# Altium project Cubesat EPS.PrjPcb (part 4 of 4)

## Sheet Ports.SchDoc
size 420 x 297 mm; SheetNumber: 21; SheetTotal: 21
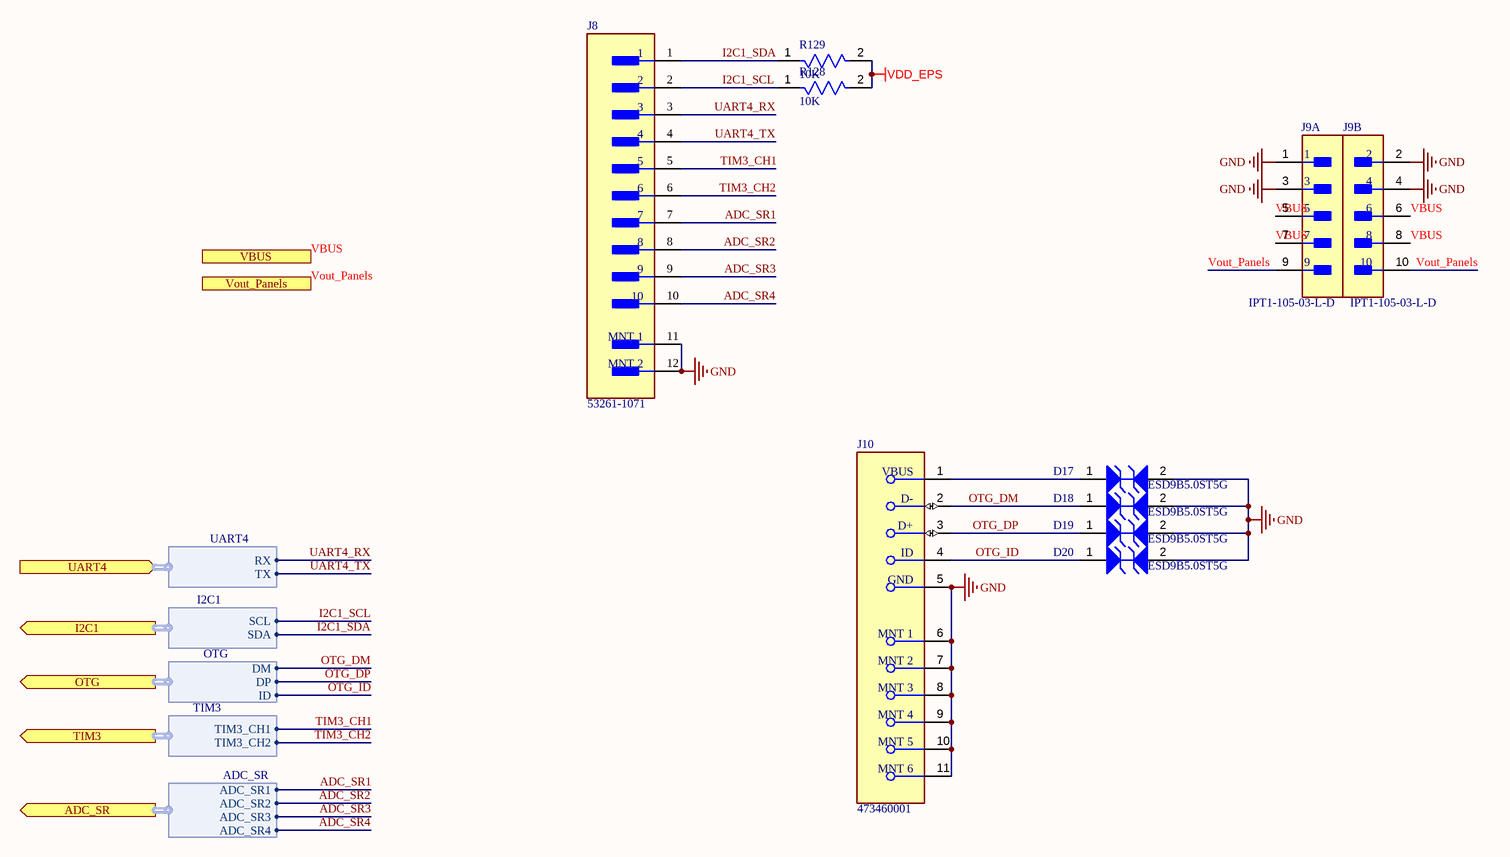
[diagram p18: Ports.SchDoc]

### Parts
D17  ESD9B5.0ST5G  [ONSC-SOD-923-2-514AB-01_V]
D18  ESD9B5.0ST5G  [ONSC-SOD-923-2-514AB-01_V]
D19  ESD9B5.0ST5G  [ONSC-SOD-923-2-514AB-01_V]
D20  ESD9B5.0ST5G  [ONSC-SOD-923-2-514AB-01_V]
J8  53261-1071  [FP-532611071-MFG]
J9  IPT1-105-03-L-D  [FP-IPT1-105-03-L-D-MFG]  (parts A,B of 2)
J10  473460001  [FP-473460001-MFG]
R128  10K  [FP-RK73B1J-MFG]
R129  10K  [FP-RK73B1J-MFG]

### Ports
ADC_SR (out, harness ADC_SR), I2C1 (out, harness I2C1), OTG (out, harness OTG), TIM3 (out, harness TIM3), UART4 (in, harness UART4), VBUS, Vout_Panels

### Harnesses
UART4: TX, RX
I2C1: SDA, SCL
OTG: DM, DP, ID
TIM3: TIM3_CH2, TIM3_CH1
ADC_SR: ADC_SR1, ADC_SR2, ADC_SR3, ADC_SR4

### Nets
GND: D17.2(A2) D18.2(A2) D19.2(A2) D20.2(A2) J8.11(MNT_1) J8.12(MNT_2) J9.1 J9.2 J9.3 J9.4 J10.5(GND) J10.6(MNT_1) J10.7(MNT_2) J10.8(MNT_3) J10.9(MNT_4) J10.10(MNT_5) J10.11(MNT_6)
VDD_EPS: R128.2 R129.2
ADC_SR1: J8.7 ; port ADC_SR.ADC_SR1
ADC_SR2: J8.8 ; port ADC_SR.ADC_SR2
ADC_SR3: J8.9 ; port ADC_SR.ADC_SR3
ADC_SR4: J8.10 ; port ADC_SR.ADC_SR4
I2C1_SCL: J8.2 R128.1 ; port I2C1.SCL
I2C1_SDA: J8.1 R129.1 ; port I2C1.SDA
OTG_DM: D18.1(A1) J10.2(D-) ; port OTG.DM
OTG_DP: D19.1(A1) J10.3(D+) ; port OTG.DP
OTG_ID: D20.1(A1) J10.4(ID) ; port OTG.ID
TIM3_CH1: J8.5 ; port TIM3.TIM3_CH1
TIM3_CH2: J8.6 ; port TIM3.TIM3_CH2
UART4_RX: J8.3 ; port UART4.RX
UART4_TX: J8.4 ; port UART4.TX
VBUS: J9.5 J9.6 J9.7 J9.8 ; port VBUS
Vout_Panels: J9.9 J9.10 ; port Vout_Panels
NetD17_1: D17.1(A1) J10.1(VBUS)

### Notes on the sheet
- THIS DOCUMENT AND THE DATA DISCLOSED HEREIN OR
- HEREWITH IS THE PROPERTY OF ALTIUM LIMITED AND MAY
- DWG NO:
- REVISION
- REV:
- DESCRIPTION
- DATE
- APPROVED
- BE FREELY DISTRIBUTED IN WHOLE. NO RIGHTS ARE
- RESERVED OR EXPRESS OR IMPLIED WARANTEE GIVEN.
- ENG:
- APPROVALS
- PROJECT
- DSN:
- CHK:
- REFERENCE DOCUMENTS
- PROJECT REVISION:
- TITLE
- DOCUMENT REVISION:
- DESIGN ITEM:
- BOM:
- FAB DWG:
- PCB DWG:
- ASSY DWG:
- SCALE:
- A3
- SIZE
- CAGE CODE
- FILE NAME
- DWG NO.
- SHEET
- OF
- REV

### Library data of the parts
D17-D20 = CMP-1063-00119-1: as D21-D23 on sheet SRIC_Peripherals; Packing: Tape and Reel; PackageDescription: 2-Pin SOD, Body 0.8 x 0.6 mm; IR Max (uA): 1; ComponentLink3Description: Package Specification; PartNumber: ESD9B5.0ST5G; ComponentLink1URL: http://www.onsemi.com/; RoHS: Pb-Free; Mounting Technology: Surface Mount; DatasheetVersion: Rev. 2; ComponentLink2URL: http://www.onsemi.cn/pub_link/Collateral/ESD9B-D.PDF; ComponentLink3URL: http://www.onsemi.com/pub_link/Collateral/514AB.PDF; PackageReference: SOD-923-2-514AB-01; PackageVersion: Rev. C, 03/2011; ComponentLink1Description: Manufacturer URL; ComponentLink2Description: Datasheet
J8 = CMP-00257-00655315-1: 53261-1071 1.25mm (.049") Pitch PicoBlade Header, Surface Mount, Right Angle, Lead-free, 10 Circuits; Manufacturer Lifecycle Status: ACTIVE; NexarPartId: 655315; Number of Circuits: 10; Gender: Male; Contact Resistance: 20mΩ; Voltage Rating: 125V; Current Rating: 1A; Glow Wire Compliant: Non-compliant; Insulation Resistance: 100MΩ; Plating: Tin; Contact Plating: Tin; Orientation: Right Angle; Number of Pins: 10; Country of Origin: SG; Housing Material: Nylon; Number of Contacts: 10; Schedule B: 8536694040, 8536694040; Height: 3.6mm; Contact Material: Tin; Max Operating Temperature: 85°C; Lead Pitch: 1.25mm; Number of Rows: 1; Lead Free: Lead Free; Packaging: Cut Tape; Pitch: 1.25mm; Min Operating Temperature: -40°C; Voltage Rating (AC): 125V; Termination: SMD/SMT, Solder; Flammability Rating: UL94 V-0; Number of Positions: 10; Width: 4.2mm; Radiation Hardening: No; Voltage Rating (DC): 125V; REACH SVHC: Unknown; Mount: Surface Mount; RoHS: Compliant; Lifecycle Status: Production; Length: 17.6mm
J9 = CMP-02770-000009-1: CONN HEADER VERT 10POS 2.54MM; Manufacturer: Samtec; Standoff Height: 0.38mm; Conn Orientation: Vertical; Number Of Contacts: 10; Voltage Rating: 1095V; Conn Gender: Male; Package: 0; Digikey Description: CONN HEADER VERT 10POS 2.54MM; Device Class L3: unset; Height: 11.43mm; Pitch: 2.54mm; Device Class L1: Connectors; Lead Free: Yes; Device Class L2: Power Connectors; ComponentLink2Description: Datasheet; Temperature Range Low: -55°C; Octopart: https://octopart.com/ipt1-105-03-l-d-samtec-19544968; ComponentLink2URL: http://suddendocs.samtec.com/prints/ipt1-1xx-xx-xx-d-xx-mkt.pdf; Temperature Range High: +125°C; Footprint Url: http://suddendocs.samtec.com/prints/ipt1-1xx-xx-x-d-xxx_ipt1-1xx-xx-x-d-ra-xxx-mkt.pdf; Temperature: -55°C to +125°C; Manufacturer Part Number: IPT1-105-03-L-D; Contact Material: Gold,Nickel; Category: Conn; Automotive: No; RoHS: TRUE
J10 = CMP-2000-05246-2: CONN RCPT USB2.0 MICRO B SMD R/A; Manufacturer: Molex; Conn Orientation: Right Angle; Is Female: yes; Shielding: true; Pitch: 0.65mm; Number Of Contacts: 5; Voltage Rating: 30V; Current Rating: 1.8A; Device Class L2: USB Connectors; Digikey Description: CONN RCPT USB2.0 MICRO B SMD R/A; Height: 2.945mm; RoHS: TRUE; ComponentLink2Description: Datasheet; Octopart: https://octopart.com/47346-0001-molex-7164928; Automotive: No; Package: 0; Category: Conn; Device Class L1: Connectors; Usb Standard: USB 2.0; Temperature: -30°C to +85°C; Temperature Range Low: -30°C; Footprint Url: https://www.molex.com/pdm_docs/sd/473460001_sd.pdf; ComponentLink2URL: https://www.molex.com/webdocs/datasheets/pdf/en-us/0473460001_IO_CONNECTORS.pdf; Lead Free: Yes; Manufacturer Part Number: 473460001; Contact Material: Gold,Nickel; Temperature Range High: +85°C; Device Class L3: unset
R128 R129 = CMP-2000-01851-2: RES 10K OHM 5% 1/10W 0603; Temperature Coefficient: 200ppm/°C; Voltage Rating: 50V; Power Rating: 100mW; Resistance: 10kR; Length: 1.6mm; Lead Free: Lead Free; Resistance Tolerance: 5%; Case Code (Metric): 1608; Width: 0.8mm; Height: 0.45mm; Max Operating Temperature: 155°C; RoHS Compliant: Yes; Resistor Type: Thick Film; Min Operating Temperature: -55°C; Case Code (Imperial): 0603; Technology: THICK FILM; Package Quantity: 5000; Tolerance: 5%; Case/Package: 0603; Voltage Rating (DC): 50V; Depth: 0.8mm; Packaging: Tape and Reel; Number of Pins: 2; Construction: Rectangular; Series: RK73B; Military Standard: Not; Termination: SMD/SMT

## Sheet SolarMppt.SchDoc
size 420 x 297 mm; SheetNumber: 2; SheetTotal: 21
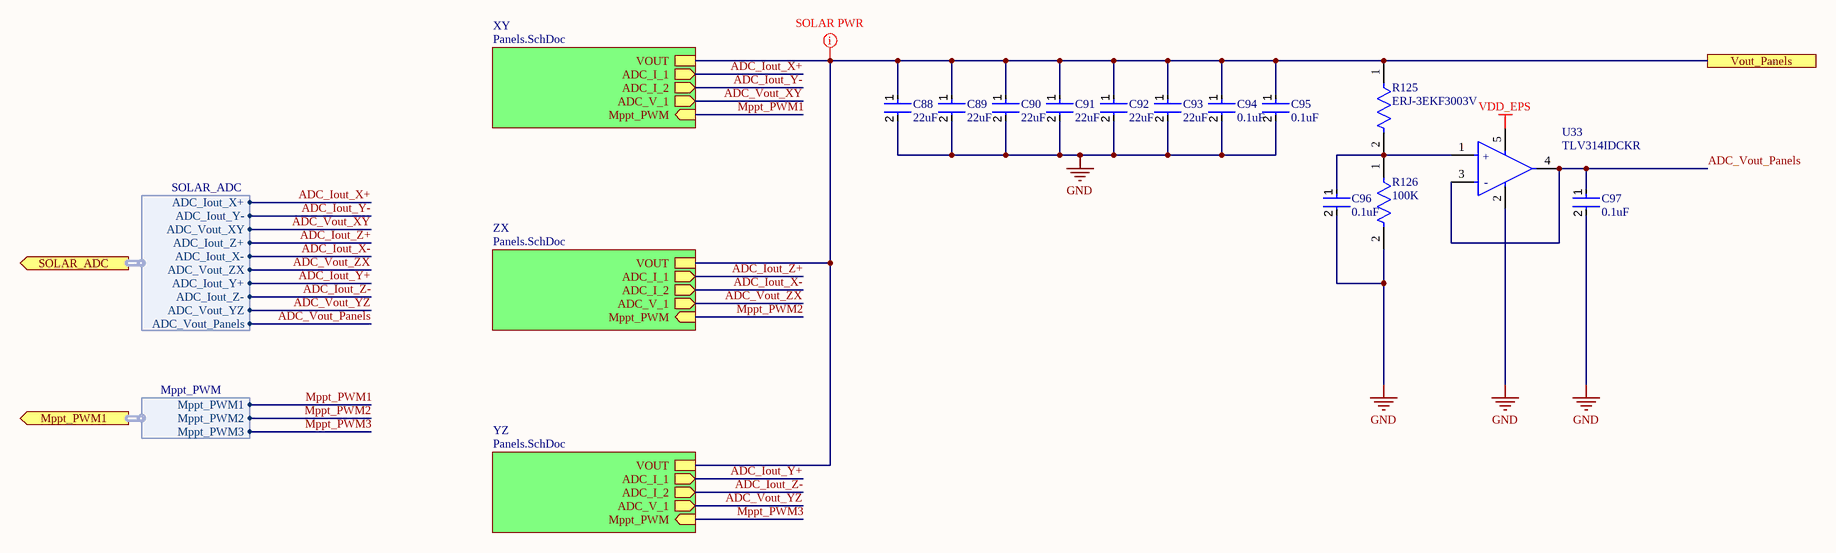
[diagram p19: SolarMppt.SchDoc]

### Parts
C88  22uF  [FP-GRM21B-0_2-e0_2_0_7-IPC_C]
C89  22uF  [FP-GRM21B-0_2-e0_2_0_7-IPC_C]
C90  22uF  [FP-GRM21B-0_2-e0_2_0_7-IPC_C]
C91  22uF  [FP-GRM21B-0_2-e0_2_0_7-IPC_C]
C92  22uF  [FP-GRM21B-0_2-e0_2_0_7-IPC_C]
C93  22uF  [FP-GRM21B-0_2-e0_2_0_7-IPC_C]
C94  0.1uF  [FP-C0603C-CF-MFG]
C95  0.1uF  [FP-C0603C-CF-MFG]
C96  0.1uF  [FP-C0603C-CF-MFG]
C97  0.1uF  [FP-C0603C-CF-MFG]
R125  ERJ-3EKF3003V  [FP-ERJ3EK-MFG]
R126  100K  [FP-ERA3A-MFG]
U33  TLV314IDCKR  [FP-DCK0005A-MFG]

### Sub-sheets
XY = Panels.SchDoc: ADC_I_1 (out), ADC_I_2 (out), ADC_V_1 (out), Mppt_PWM (in), VOUT
YZ = Panels.SchDoc: ADC_I_1 (out), ADC_I_2 (out), ADC_V_1 (out), Mppt_PWM (in), VOUT
ZX = Panels.SchDoc: ADC_I_1 (out), ADC_I_2 (out), ADC_V_1 (out), Mppt_PWM (in), VOUT

### Ports
Mppt_PWM1 (out, harness Mppt_PWM), SOLAR_ADC (out, harness SOLAR_ADC), Vout_Panels

### Harnesses
SOLAR_ADC: ADC_Iout_X+, ADC_Iout_Y-, ADC_Vout_XY, ADC_Iout_Z+, ADC_Iout_X-, ADC_Vout_ZX, ADC_Iout_Y+, ADC_Iout_Z-, ADC_Vout_YZ, ADC_Vout_Panels
Mppt_PWM: Mppt_PWM1, Mppt_PWM2, Mppt_PWM3

### Nets
GND: C88.2 C89.2 C90.2 C91.2 C92.2 C93.2 C94.2 C95.2 C96.2 C97.2 R126.2 U33.2(V-)
VDD_EPS: U33.5(V+)
ADC_Iout_X+: sheet XY/ADC_I_1, port SOLAR_ADC.ADC_Iout_X+  [project net ADC1_IN12]
ADC_Iout_X-: sheet ZX/ADC_I_2, port SOLAR_ADC.ADC_Iout_X-  [project net ADC1_IN9]
ADC_Iout_Y+: sheet YZ/ADC_I_1, port SOLAR_ADC.ADC_Iout_Y+  [project net ADC1_IN8]
ADC_Iout_Y-: sheet XY/ADC_I_2, port SOLAR_ADC.ADC_Iout_Y-  [project net ADC1_IN11]
ADC_Iout_Z+: sheet ZX/ADC_I_1, port SOLAR_ADC.ADC_Iout_Z+  [project net ADC1_IN10]
ADC_Iout_Z-: sheet YZ/ADC_I_2, port SOLAR_ADC.ADC_Iout_Z-  [project net ADC1_IN7]
ADC_Vout_Panels: C97.1 U33.3(-IN) U33.4(OUT) ; port SOLAR_ADC.ADC_Vout_Panels  [project net ADC1_IN16]
ADC_Vout_XY: sheet XY/ADC_V_1, port SOLAR_ADC.ADC_Vout_XY  [project net ADC1_IN15]
ADC_Vout_YZ: sheet YZ/ADC_V_1, port SOLAR_ADC.ADC_Vout_YZ  [project net ADC1_IN13]
ADC_Vout_ZX: sheet ZX/ADC_V_1, port SOLAR_ADC.ADC_Vout_ZX  [project net ADC1_IN14]
Mppt_PWM1: sheet XY/Mppt_PWM, port Mppt_PWM1.Mppt_PWM1
Mppt_PWM2: sheet ZX/Mppt_PWM, port Mppt_PWM1.Mppt_PWM2
Mppt_PWM3: sheet YZ/Mppt_PWM, port Mppt_PWM1.Mppt_PWM3
Vout_Panels: C88.1 C89.1 C90.1 C91.1 C92.1 C93.1 C94.1 C95.1 R125.1 ; port Vout_Panels, sheet XY/VOUT, sheet ZX/VOUT, sheet YZ/VOUT
NetC96_1: C96.1 R125.2 R126.1 U33.1(+IN)

### Layout directives
net class SOLAR PWR: Vout_Panels

### Notes on the sheet
- THIS DOCUMENT AND THE DATA DISCLOSED HEREIN OR
- HEREWITH IS THE PROPERTY OF ALTIUM LIMITED AND MAY
- DWG NO:
- REVISION
- REV:
- DESCRIPTION
- DATE
- APPROVED
- BE FREELY DISTRIBUTED IN WHOLE. NO RIGHTS ARE
- RESERVED OR EXPRESS OR IMPLIED WARANTEE GIVEN.
- ENG:
- APPROVALS
- PROJECT
- DSN:
- CHK:
- REFERENCE DOCUMENTS
- PROJECT REVISION:
- TITLE
- DOCUMENT REVISION:
- DESIGN ITEM:
- BOM:
- FAB DWG:
- PCB DWG:
- ASSY DWG:
- SCALE:
- A3
- SIZE
- CAGE CODE
- FILE NAME
- DWG NO.
- SHEET
- OF
- REV
- (in symbol CMP-04895-000170-1) +; -

### Library data of the parts
C88-C93 = CMP-06035-025845-1: Chip Multilayer Ceramic Capacitors for General Purpose, 0805, 22uF, X7T, +22%/-33%, 20%, 10V; Dissipation Factor: 0.035%; Height: 1.25mm; Min Operating Temperature: -55°C; Case/Package: 0805; Packaging: Tape and Reel; Voltage: 10V; Depth: 1.25mm; Width: 1.25mm; Voltage Rating: 10V; Dielectric: X7T; Weight: 0.000335oz; Capacitance: 22uF; Mount: Surface Mount; Package Quantity: 3000; Lead Free: Lead Free; Tolerance: 20%; Thickness: 0.057inch; Max Operating Temperature: 125°C; Length: 2mm; Material: Ceramic; Case Code (Metric): 2012; Termination: SMD/SMT; Voltage Rating (DC): 10V; Dielectric Material: Ceramic; Case Code (Imperial): 0805
C94 C95 = CMP-2006-03054-2: CAP CER 0.1UF 16V X7R 0603; Manufacturer: KEMET; Manufacturer Part Number: C0603C104J4RACTU; Material: Ceramic; Capacitance: 0.10 μF; Tolerance: 0.05; Automotive Grade: Grade 1; Value: 0.10 μF; Temperature Coefficient: 30ppm/°C; Digikey Description: CAP CER 0.1UF 16V X7R 0603; Automotive: Yes; Octopart: https://octopart.com/c0603c104j4ractu-kemet-102515; Device Class L2: Capacitors; Temperature Characteristic: X7R; Category: Cap; Mouser Description: Cap Ceramic 0.1uF 16V X7R 5% SMD 0603 125°C Paper T/R; Voltage Rating: 16 V; Temperature Range Low: -55°C; Device Class L1: Passive Components; ComponentLink2URL: https://api.kemet.com/component-edge/download/datasheet/C0603C100J5GACAUTO.pdf; Lead Free: Yes; Temperature Range High: +125°C; Height: 0.87mm; Device Class L3: Ceramic Capacitors; ComponentLink2Description: Datasheet; Package: C0603C-CF; RoHS: TRUE; Temperature: -55°C to +125°C
C96 C97 = CMP-2006-03061-2: CAP CER 0.1UF 50V X7R 0603; Manufacturer: KEMET; Manufacturer Part Number: C0603C104K5RACTU; Tolerance: 0.1; Temperature Coefficient: 30ppm/°C; Material: Ceramic; Automotive Grade: Grade 1; Value: 0.10 μF; Temperature: -55°C to +125°C; RoHS: TRUE; Temperature Range High: +125°C; Lead Free: Yes; Octopart: https://octopart.com/c0603c104k5ractu-kemet-139244; Digikey Description: CAP CER 0.1UF 50V X7R 0603; Category: Cap; Package: C0603C-CF; ComponentLink2Description: Datasheet; Temperature Range Low: -55°C; Device Class L1: Passive Components; Voltage Rating: 50 V; Automotive: Yes; Device Class L3: Ceramic Capacitors; ComponentLink2URL: https://api.kemet.com/component-edge/download/datasheet/C0603C100J5GACAUTO.pdf; Capacitance: 0.10 μF; Device Class L2: Capacitors; Temperature Characteristic: X7R; Height: 0.87mm
R125 = CMP-2000-00414-2: NexarPartId: 41621939; Resistance: 300kΩ; Max Power Dissipation: 100mW; Voltage Rating: 75V; Tolerance: 1%; Temperature Coefficient: 100ppm/°C; Military Standard: Not; Number of Terminations: 2; Termination: SMD/SMT; RoHS: Compliant; Min Operating Temperature: -55°C; Schedule B: 8533210045, 8533210045; Height: 558.8µm; REACH SVHC: No SVHC; Case/Package: 0603; Lead Free: Lead Free; Case Code (Imperial): 0603; Case Code (Metric): 1608; Depth: 800µm; Composition: Thick Film; Mount: Surface Mount; Radiation Hardening: No; Features: Automotive AEC-Q200; Width: 787.4µm; Packaging: Cut Tape; Contact Plating: Tin; Length: 1.6mm; Power Rating: 100mW; Lifecycle Status: Production; Voltage Rating (DC): 75V; Max Operating Temperature: 155°C
R126 = CMP-2000-00875-2: NexarPartId: 1243428; Power Rating: 100mW; Voltage Rating (DC): 75V; Tolerance: 0.1%; Temperature Coefficient: 25ppm/°C; Resistance: 100kΩ; Contact Plating: Tin; Max Operating Temperature: 155°C; Case Code (Imperial): 0603; Packaging: Cut Tape; Width: 800µm; Lead Free: Lead Free; REACH SVHC: No SVHC; Termination: SMD/SMT; Radiation Hardening: No; Length: 1.6mm; Military Standard: Not; Features: Automotive AEC-Q200; Case/Package: 0603; Number of Terminations: 2; Composition: Thin Film; Schedule B: 8533210045, 8533210045; Voltage Rating: 75V; Mount: Surface Mount; Case Code (Metric): 1608; Lifecycle Status: Production; Height: 450µm; RoHS: Compliant; Number of Pins: 2; Max Power Dissipation: 100mW; Min Operating Temperature: -55°C; Depth: 800µm; Working Voltage: 75V
U33 = CMP-04895-000170-1: IC CMOS 1 CIRCUIT SC70-5; Gain Bandwidth Product: 3MHz; Number of Channels: 1; Lead Free: Lead Free; Min Operating Temperature: -40°C; RoHS Compliant: Yes; Max Operating Temperature: 125°C; Number of Pins: 5

## Sheet Panels.SchDoc
size 420 x 297 mm; SheetNumber: 3; SheetTotal: 21
Used 3 times, as channels U_SolarMppt/XY, U_SolarMppt/ZX, U_SolarMppt/YZ. Parts and nets are listed once, with the designators drawn on the sheet.
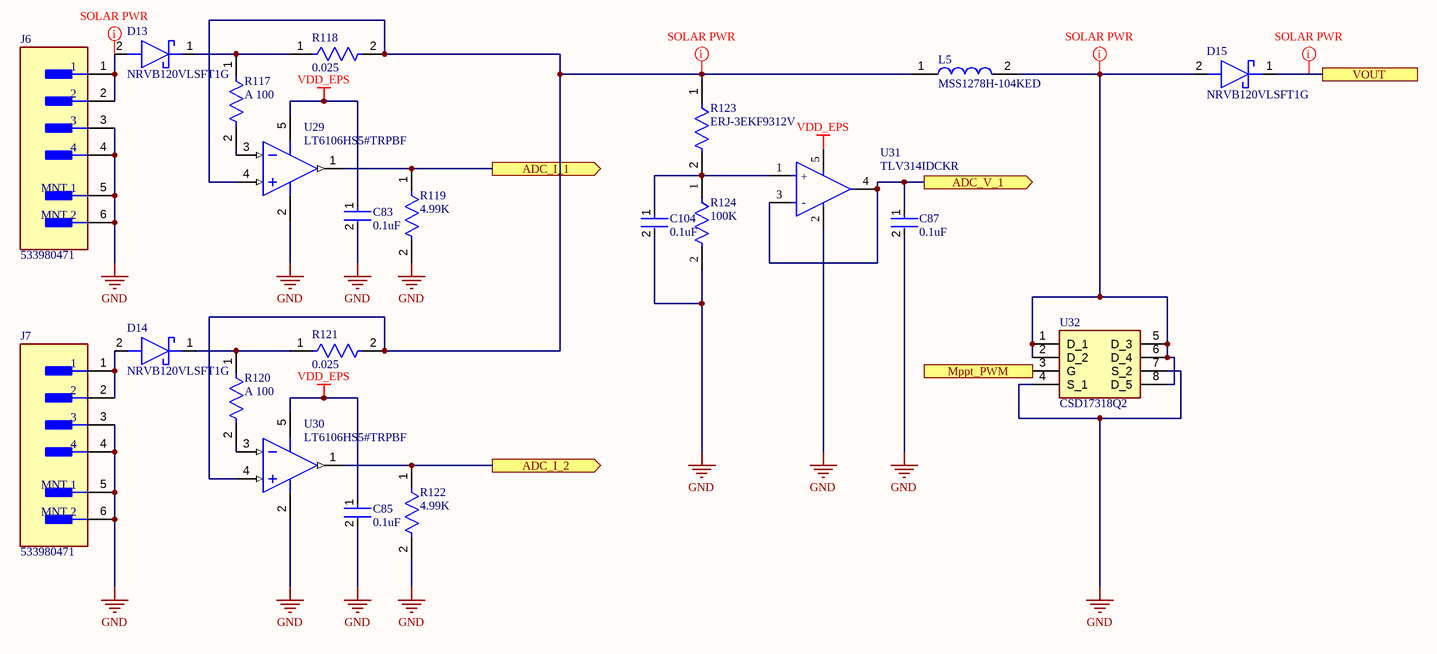
[diagram p20: Panels.SchDoc]

### Parts
C83  0.1uF  [FP-C0603C-CF-MFG]
C85  0.1uF  [FP-C0603C-CF-MFG]
C87  0.1uF  [FP-C0603C-CF-MFG]
C104  0.1uF  [FP-C0603C-CF-MFG]
D13  NRVB120VLSFT1G  [SODFL3616X98N]
D14  NRVB120VLSFT1G  [SODFL3616X98N]
D15  NRVB120VLSFT1G  [SODFL3616X98N]
J6  533980471  [FP-533980471-MFG]
J7  533980471  [FP-533980471-MFG]
L5  MSS1278H-104KED  [INDPM120120X805N]
R117  A 100  [FP-ERA3A-IPC_B]
R118  0.025  [FP-PRL0816-MFG]
R119  4.99K  [FP-ERA3A-IPC_C]
R120  A 100  [FP-ERA3A-IPC_B]
R121  0.025  [FP-PRL0816-MFG]
R122  4.99K  [FP-ERA3A-IPC_C]
R123  ERJ-3EKF9312V  [FP-ERJ3EK-IPC_C]
R124  100K  [FP-ERA3A-MFG]
U29  LT6106HS5#TRPBF  [LT-S5-5-TSOT-23_M]
U30  LT6106HS5#TRPBF  [LT-S5-5-TSOT-23_M]
U31  TLV314IDCKR  [FP-DCK0005A-MFG]
U32  CSD17318Q2  [CSD17318Q2]

### Ports
ADC_I_1 (out), ADC_I_2 (out), ADC_V_1 (out), Mppt_PWM (in), VOUT

### Nets
GND: C83.2 C85.2 C87.2 C104.2 J6.3 J6.4 J6.5(MNT_1) J6.6(MNT_2) J7.3 J7.4 J7.5(MNT_1) J7.6(MNT_2) R119.2 R122.2 R124.2 U29.2(V-) U30.2(V-) U31.2(V-) U32.4(S_1) U32.7(S_2)
VDD_EPS: C83.1 C85.1 U29.5(V+) U30.5(V+) U31.5(V+)
ADC_I_1: R119.1 U29.1(OUT) ; port ADC_I_1
ADC_I_2: R122.1 U30.1(OUT) ; port ADC_I_2
ADC_V_1: C87.1 U31.3(-IN) U31.4(OUT) ; port ADC_V_1
Mppt_PWM: U32.3(G) ; port Mppt_PWM
VOUT: D15.1(K) ; port VOUT
NetC104_1: C104.1 R123.2 R124.1 U31.1(+IN)
NetD13_1: D13.1(K) R117.1 R118.1
NetD13_2: D13.2(A) J6.1 J6.2
NetD14_1: D14.1(K) R120.1 R121.1
NetD14_2: D14.2(A) J7.1 J7.2
NetD15_2: D15.2(A) L5.2 U32.1(D_1) U32.2(D_2) U32.5(D_3) U32.6(D_4) U32.8(D_5)
NetL5_1: L5.1 R118.2 R121.2 R123.1 U29.4(+IN) U30.4(+IN)
NetR117_2: R117.2 U29.3(-IN)
NetR120_2: R120.2 U30.3(-IN)

### Channels
U_SolarMppt/XY: designators end in _XY; ports ADC_I_1=ADC1_IN12 ADC_I_2=ADC1_IN11 ADC_V_1=ADC1_IN15 Mppt_PWM=Mppt_PWM1 VOUT=Vout_Panels
U_SolarMppt/ZX: designators end in _ZX; ports ADC_I_1=ADC1_IN10 ADC_I_2=ADC1_IN9 ADC_V_1=ADC1_IN14 Mppt_PWM=Mppt_PWM2 VOUT=Vout_Panels
U_SolarMppt/YZ: designators end in _YZ; ports ADC_I_1=ADC1_IN8 ADC_I_2=ADC1_IN7 ADC_V_1=ADC1_IN13 Mppt_PWM=Mppt_PWM3 VOUT=Vout_Panels

### Layout directives
net class SOLAR PWR: NetD13_XY_2, NetD15_XY_2, NetL5_XY_1, Vout_Panels

### Notes on the sheet
- THIS DOCUMENT AND THE DATA DISCLOSED HEREIN OR
- HEREWITH IS THE PROPERTY OF ALTIUM LIMITED AND MAY
- DWG NO:
- REVISION
- REV:
- DESCRIPTION
- DATE
- APPROVED
- BE FREELY DISTRIBUTED IN WHOLE. NO RIGHTS ARE
- RESERVED OR EXPRESS OR IMPLIED WARANTEE GIVEN.
- ENG:
- APPROVALS
- PROJECT
- DSN:
- CHK:
- REFERENCE DOCUMENTS
- PROJECT REVISION:
- TITLE
- DOCUMENT REVISION:
- DESIGN ITEM:
- BOM:
- FAB DWG:
- PCB DWG:
- ASSY DWG:
- SCALE:
- A3
- SIZE
- CAGE CODE
- FILE NAME
- DWG NO.
- SHEET
- OF
- REV
- (in symbol CMP-04895-000170-1) +; -

### Library data of the parts
C83 C85 C87 C104 = CMP-2006-03061-2: as C96 on sheet SolarMppt; Temperature: -55°C to +125°C; RoHS: TRUE; Temperature Range High: +125°C; Lead Free: Yes; Octopart: https://octopart.com/c0603c104k5ractu-kemet-139244; Digikey Description: CAP CER 0.1UF 50V X7R 0603; Category: Cap; Package: C0603C-CF; ComponentLink2Description: Datasheet; Temperature Range Low: -55°C; Device Class L1: Passive Components; Voltage Rating: 50 V; Automotive: Yes; Device Class L3: Ceramic Capacitors; ComponentLink2URL: https://api.kemet.com/component-edge/download/datasheet/C0603C100J5GACAUTO.pdf; Capacitance: 0.10 μF; Device Class L2: Capacitors; Temperature Characteristic: X7R; Height: 0.87mm
D13-D15 = NRVB120VLSFT1G: Schottky Diode; Manufacturer_Name: onsemi; Datasheet Link: https://www.onsemi.com/pub/Collateral/MBR120VLSFT1-D.PDF; Height: 0.98mm; Manufacturer_Part_Number: NRVB120VLSFT1G; Mouser Part Number: 863-NRVB120VLSFT1G; Mouser Price/Stock: https://www.mouser.co.uk/ProductDetail/onsemi/NRVB120VLSFT1G?qs=tCMd4XlZ%2FiDc2vkUzw3hig%3D%3D; Arrow Part Number: NRVB120VLSFT1G; Arrow Price/Stock: null?utm_currency=USD&region=nac
J6 J7 = CMP-04776-000105-1: CONN HEADER SMD 4POS 1.25MM; Manufacturer: Molex; Conn Gender: Male; Conn Orientation: Vertical; Standoff Height: 0.05mm; Number Of Contacts: 4; Current Rating: 1A; Voltage Rating: 125V; Package: 0; ComponentLink2Description: Datasheet; ComponentLink2URL: https://www.molex.com/pdm_docs/ps/PS-51021-024-001.pdf; Ambient Temperature Range Low: -40°C; Category: Conn; Automotive: No; Number Of Rows: 1; Device Class L3: unset; Ambient Temperature Range High: +105°C; Height: 5.1mm; Lead Free: Yes; Pitch: 1.25mm; Contact Material: Tin; Footprint Url: https://www.molex.com/pdm_docs/sd/533980471_sd.pdf; Octopart: https://octopart.com/53398-0471-molex-655296; Temperature Range Low: -40°C; Device Class L2: Headers and Wire Housings; Temperature: -40°C to +105°C; Digikey Description: CONN HEADER SMD 4POS 1.25MM; RoHS: TRUE; Manufacturer Part Number: 533980471; Device Class L1: Connectors; Temperature Range High: +105°C
L5 = CMP-006-00046-2: Fixed Inductors 100uH Shld 2.3A 10% DCR-121mOhmsAEC-Q200; Manufacturer_Name: COILCRAFT; Height: 8.05mm; Source: SamacSys.SchLib; Manufacturer_Part_Number: MSS1278H-104KED; Mouser Price/Stock: https://www.mouser.co.uk/ProductDetail/Coilcraft/MSS1278H-104KED?qs=KUoIvG%2F9IlbXnL7JW4S4%2FA%3D%3D; Design Item ID: MSS1278H-104KED; Datasheet Link: https://www.coilcraft.com/getmedia/72ffd561-3941-457d-b0e7-bb55b1b2d1a7/MSS1278H.pdf; Mouser Part Number: 994-MSS1278H-104KED
R117 R120 = CMP-2000-00870-2: RES SMD 100 OHM 0.1% 1/10W 0603; Voltage Rating: 75V; Power Rating: 100mW; Resistance: 100R; Temperature Coefficient: 25ppm/°C; Number of Terminations: 2; Case/Package: 0603; Termination: SMD/SMT; Number of Pins: 2; Size Code: 0603; Length: 1.6mm; Min Operating Temperature: -55°C; Resistor Type: Thin Film; Depth: 0.8mm; Military Standard: Not; Packaging: Tape and Reel; RoHS Compliant: Yes; Construction: Rectangular; Resistance Tolerance: 0.1%; Contact Plating: Tin; Width: 0.8mm; Mount: Surface Mount; Case Code (Metric): 1608; Max Operating Temperature: 155°C; Height: 0.45mm; Case Code (Imperial): 0603; Series: ERA-3A; Package Quantity: 5000; REACH SVHC: No SVHC; Tolerance: 0.1%; Max Power Dissipation: 100mW; Radiation Hardening: No; Technology: METAL FILM
R118 R121 = CMP-28537-000948-1: 25 mOhms ±1% 0.33W Chip Resistor Wide 0306 (0816 Metric), Current Sense Thin Film; Temperature Coefficient: 200ppm/°C; Resistance: 25mR; Power Rating: 330mW; Tolerance: 1%; Case Code (Metric): 0816; Packaging: Tape and Reel; RoHS Compliant: Yes; Height: 0.4mm; Termination: SMD/SMT; Case Code (Imperial): 0306; Technology: THIN FILM; Package Quantity: 1000; Length: 1.6mm; Width: 0.8mm; Series: PRL
R119 R122 = CMP-2000-00077-5: RES SMD 4.99KOHM 0.1% 1/10W 0603; Voltage Rating (DC): 75V; Max Power Dissipation: 100mW; Temperature Coefficient: 25ppm/°C; Resistance: 4.99kR; Voltage Rating: 150V; Features: Automotive AEC-Q200; Depth: 0.8mm; Case Code (Imperial): 0603; Resistance Tolerance: 0.1%; Mount: Surface Mount; Contact Plating: Tin; Length: 1.6mm; RoHS Compliant: Yes; Termination: SMD/SMT; Width: 0.8mm; Case/Package: 0603; Series: ERA; Radiation Hardening: No; Tolerance: 0.1%; Lead Free: Lead Free; Technology: METAL FILM; Construction: Rectangular; Number of Terminations: 2; Weight: 7.1E-05oz; Power Rating: 100mW; Number of Pins: 2; Min Operating Temperature: -55°C; Height: 0.45mm; Case Code (Metric): 1608; Package Quantity: 5000; Military Standard: Not; Max Operating Temperature: 155°C; Resistor Type: Thin Film; Reach SVHC Compliant: Yes; Packaging: Tape and Reel
R123 = CMP-2000-00690-5: RES SMD 93.1K OHM 1% 1/10W 0603; Resistance: 93.1kR; Temperature Coefficient: 100ppm/°C; Voltage Rating (DC): 50V; Voltage Rating: 75V; Power Rating: 100mW; Radiation Hardening: No; Series: ERJ; Tolerance: 1%; Packaging: Tape and Reel; Lead Free: Lead Free; Weight: 7.1E-05oz; Features: Automotive AEC-Q200; Resistor Type: Thick Film; Reach SVHC Compliant: Yes; Mount: Surface Mount; Military Standard: Not; Package Quantity: 1; RoHS Compliant: Yes; Case/Package: 0603; Contact Plating: Tin; Termination: SMD/SMT; Length: 1.6mm; Case Code (Metric): 1608; Max Operating Temperature: 155°C; Resistance Tolerance: 1%; Height: 0.022inch; Depth: 0.8mm; Construction: Rectangular; Max Power Dissipation: 100mW; Width: 0.8mm; Number of Terminations: 2; Min Operating Temperature: -55°C; Case Code (Imperial): 0603
R124 = CMP-2000-00875-2: as R126 on sheet SolarMppt; Contact Plating: Tin; Max Operating Temperature: 155°C; Case Code (Imperial): 0603; Packaging: Cut Tape; Width: 800µm; Lead Free: Lead Free; REACH SVHC: No SVHC; Termination: SMD/SMT; Radiation Hardening: No; Length: 1.6mm; Military Standard: Not; Features: Automotive AEC-Q200; Case/Package: 0603; Number of Terminations: 2; Composition: Thin Film; Schedule B: 8533210045, 8533210045; Voltage Rating: 75V; Mount: Surface Mount; Case Code (Metric): 1608; Lifecycle Status: Production; Height: 450µm; RoHS: Compliant; Number of Pins: 2; Max Power Dissipation: 100mW; Min Operating Temperature: -55°C; Depth: 800µm; Working Voltage: 75V
U29 U30 = CMP-0359-01984-2: Single Channel, Low Cost, High Side Current Sense Operational Amplifier, 0.2 MHz Typical GBW, 5-Pin SOT-23 (S5-5), High Temperature / Automotive, Pb-Free, Reel; Manufacturer: Linear Technology; Linear Technology Part Number: LT6106; Vos (mV) Typical: 0.15; Vs Min (V): 2.7; Vs Max (V): 36; Is (mA) Typical: 0.06; Vos (mV) Guaranteed: 0.25; Channels (#): 1; GBW (MHz) Typical: 0.2; PackageDescription: 5-Lead Plastic TSOT-23, Body 1.63 x 2.90 mm, Pitch 0.95 mm; ComponentLink3Description: Package Specification; Mounting Technology: Surface Mount; Type: CSA; RevisionNote: URLs updated; ComponentLink2URL: http://cds.linear.com/docs/en/datasheet/6106fa.pdf; ComponentLink1URL: http://www.linear.com/; Code_JEDEC: MO-193; PartNumber: LT6106HS5#TRPBF; Packing: Reel; DatasheetVersion: Rev. A; RoHS: Pb-Free; ComponentLink3URL: http://cds.linear.com/docs/en/packaging/SOT_5_05-08-1635.pdf; ComponentLink1Description: Manufacturer URL; PackageReference: LT-S5-5-TSOT-23; ComponentLink2Description: Datasheet
U31 = CMP-04895-000170-1: as U33 on sheet SolarMppt; Lead Free: Lead Free; Min Operating Temperature: -40°C; RoHS Compliant: Yes; Max Operating Temperature: 125°C; Number of Pins: 5
U32 = CSD17318Q2: Integrated Circuit; Manufacturer_Name: Texas Instruments; Datasheet Link: https://www.ti.com/lit/ds/symlink/csd17318q2.pdf?ts=1704287484498&ref_url=https%253A%252F%252Fwww.ti.com%252Fproduct%252FCSD17318Q2; Height: 0.8mm; Manufacturer_Part_Number: CSD17318Q2; Mouser Part Number: 595-CSD17318Q2; Mouser Price/Stock: https://www.mouser.co.uk/ProductDetail/Texas-Instruments/CSD17318Q2?qs=HXFqYaX1Q2yFLkhHL33iLQ%3D%3D; Arrow Part Number: CSD17318Q2; Arrow Price/Stock: https://www.arrow.com/en/products/csd17318q2/texas-instruments?utm_currency=USD&region=nac

## Nets that join several sheets
GND: PMIC (U19.2), PMIC_Watchdog (C67.2 R67.1 U20.2), PMIC_Power (17 pins), PMIC_Crystal (6 pins), PMIC_Debug (5 pins), PC104-52-52 (12 pins), Mram (C78.2 U26.4 U26.9), CAN1 (C79.2 C80.2 D11.3 U27.2), CAN2 (C81.2 C82.2 D12.3 U28.2), A (20 pins), 5V0_VoltageReg (20 pins), 3V3_MCU (19 pins), 3V3_EPS (19 pins), M (9 pins), SetResetIC (11 pins), SRIC_Peripherals (14 pins), OR_Gate (40 pins), Ports (17 pins), SolarMppt (12 pins), U_SolarMppt/XY (20 pins), U_SolarMppt/ZX (20 pins), U_SolarMppt/YZ (20 pins), B (20 pins), N (9 pins)
VDD_EPS: PMIC (U19.5), PMIC_Watchdog (5 pins), PMIC_Power (17 pins), PMIC_Debug (5 pins), Mram (5 pins), CAN1 (C79.1 U27.3), CAN2 (C81.1 U28.3), 3V3_EPS (C11.1 Q2.4 Q2.7 U3.3), OR_Gate (D9.2), Ports (R128.2 R129.2), SolarMppt (U33.5), U_SolarMppt/XY (5 pins), U_SolarMppt/ZX (5 pins), U_SolarMppt/YZ (5 pins)
VDD_SR: 3V3_EPS (C9.1 Q1.4 Q1.7 U2.3), SetResetIC (11 pins), SRIC_Peripherals (9 pins), OR_Gate (D9.1)
3V3_1: PC104-52-52 (H1.47 H1.48 H1.49 R131.1), A (C33_A.2 R33_A.2 R34_A.2 U9_A.4)
3V3_2: PC104-52-52 (H1.50 H1.51 H1.52 R132.1), B (C33_B.2 R33_B.2 R34_B.2 U9_B.4)
5V0: PC104-52-52 (5 pins), 5V0_VoltageReg (C43.2 R44.2 R45.2 U12.4)
ADC1_IN5: PMIC (U18.23), A (R35_A.1 U9_A.1)
ADC1_IN6: PMIC (U18.24), 3V3_MCU (R24.1 U6.1)
ADC1_IN7: PMIC (U18.25), U_SolarMppt/YZ (R122_YZ.1 U30_YZ.1)
ADC1_IN8: PMIC (U18.26), U_SolarMppt/YZ (R119_YZ.1 U29_YZ.1)
ADC1_IN9: PMIC (U18.29), U_SolarMppt/ZX (R122_ZX.1 U30_ZX.1)
ADC1_IN10: PMIC (U18.30), U_SolarMppt/ZX (R119_ZX.1 U29_ZX.1)
ADC1_IN11: PMIC (U18.31), U_SolarMppt/XY (R122_XY.1 U30_XY.1)
ADC1_IN12: PMIC (U18.32), U_SolarMppt/XY (R119_XY.1 U29_XY.1)
ADC1_IN13: PMIC (U18.33), U_SolarMppt/YZ (C87_YZ.1 U31_YZ.3 U31_YZ.4)
ADC1_IN14: PMIC (U18.34), U_SolarMppt/ZX (C87_ZX.1 U31_ZX.3 U31_ZX.4)
ADC1_IN15: PMIC (U18.35), U_SolarMppt/XY (C87_XY.1 U31_XY.3 U31_XY.4)
ADC1_IN16: PMIC (U18.36), SolarMppt (C97.1 U33.3 U33.4)
ADC3_IN1: PMIC (U18.15), N (R56_N.2 R57_N.1)
ADC3_IN2: PMIC (U18.16), M (R56_M.2 R57_M.1)
ADC3_IN3: PMIC (U18.17), 5V0_VoltageReg (R47.2 R48.1)
ADC3_IN4: PMIC (U18.18), B (R35_B.1 U9_B.1)
ADC_SR1: SetResetIC (U15.10), Ports (J8.7)
ADC_SR2: SetResetIC (U15.11), Ports (J8.8)
ADC_SR3: SetResetIC (U15.14), Ports (J8.9)
ADC_SR4: SetResetIC (U15.15), Ports (J8.10)
CAN1_RX: PMIC (U18.81), CAN1 (U27.1)
CAN1_TX: PMIC (U18.82), CAN1 (U27.4)
CAN2_RX: PMIC (U18.51), CAN2 (U28.1)
CAN2_TX: PMIC (U18.52), CAN2 (U28.4)
CAN_A_H: PC104-52-52 (H1.3), CAN1 (D11.2 R113.1 U27.7)
CAN_A_L: PC104-52-52 (H1.1), CAN1 (D11.1 R114.2 U27.6)
CAN_B_H: PC104-52-52 (H1.2), CAN2 (D12.2 R115.1 U28.7)
CAN_B_L: PC104-52-52 (H1.4), CAN2 (D12.1 R116.2 U28.6)
DEBUG_LED1: PMIC (U18.98), PMIC_Debug (D1.1)
DEBUG_LED1_SR: SetResetIC (U15.46), SRIC_Peripherals (D13.1)
DEBUG_LED2: PMIC (U18.1), PMIC_Debug (D2.1)
DEBUG_LED2_SR: SetResetIC (U15.45), SRIC_Peripherals (D14.1)
DEBUG_LED3: PMIC (U18.2), PMIC_Debug (D3.1)
DEBUG_LED3_SR: SetResetIC (U15.43), SRIC_Peripherals (D15.1)
DEBUG_LED4: PMIC (U18.3), PMIC_Debug (D4.1)
DEBUG_LED4_SR: SetResetIC (U15.42), SRIC_Peripherals (D16.1)
DEBUG_LED5: PMIC (U18.4), PMIC_Debug (D5.1)
DEBUG_UART_RX: PMIC (U18.93), PMIC_Debug (D8.1 J4.3)
DEBUG_UART_TX: PMIC (U18.68), PMIC_Debug (D7.1 J4.2)
DONE: PMIC (U18.65), PMIC_Watchdog (U20.4)
DONE_SR: SetResetIC (U15.33), SRIC_Peripherals (U17.4)
EN_3V3_1: A (Q7_A.1), OR_Gate (R91.2 U22.3)
EN_3V3_1_BUCK: A (R25_A.2 U7_A.12), OR_Gate (R90.2 U22.7)
EN_3V3_1_BUCK_EPS: PMIC (U18.58), OR_Gate (R87.2 U22.2)
EN_3V3_1_BUCK_SR: SetResetIC (U15.26), OR_Gate (R86.2 U22.1)
EN_3V3_1_EPS: PMIC (U18.45), OR_Gate (R89.2 U22.6)
EN_3V3_1_SR: SetResetIC (U15.27), OR_Gate (R88.2 U22.5)
EN_3V3_2: OR_Gate (R97.2 U23.3), B (Q7_B.1)
EN_3V3_2_BUCK: OR_Gate (R96.2 U23.7), B (R25_B.2 U7_B.12)
EN_3V3_2_BUCK_EPS: PMIC (U18.46), OR_Gate (R93.2 U23.2)
EN_3V3_2_BUCK_SR: SetResetIC (U15.18), OR_Gate (R92.2 U23.1)
EN_3V3_2_EPS: PMIC (U18.57), OR_Gate (R95.2 U23.6)
EN_3V3_2_SR: SetResetIC (U15.19), OR_Gate (R94.2 U23.5)
EN_5V: 5V0_VoltageReg (Q9.1), OR_Gate (R103.2 U24.3)
EN_5V_BOOST: 5V0_VoltageReg (R36.1 U10.7), OR_Gate (R102.2 U24.7)
EN_5V_BOOST_EPS: PMIC (U18.37), OR_Gate (R99.2 U24.2)
EN_5V_BOOST_SR: SetResetIC (U15.28), OR_Gate (R98.2 U24.1)
EN_5V_EPS: PMIC (U18.38), OR_Gate (R101.2 U24.6)
EN_5V_SR: SetResetIC (U15.29), OR_Gate (R100.2 U24.5)
EN_MCU_3V3: 3V3_MCU (Q5.1), OR_Gate (R85.2 U21.3)
EN_MCU_3V3_EPS: PMIC (U18.55), OR_Gate (R83.2 U21.6)
EN_MCU_3V3_SR: SetResetIC (U15.17), OR_Gate (R82.2 U21.5)
EN_MCU_BUCK: 3V3_MCU (Q4.1), OR_Gate (R84.2 U21.7)
EN_MCU_BUCK_EPS: PMIC (U18.56), OR_Gate (R81.2 U21.2)
EN_MCU_BUCK_SR: SetResetIC (U15.16), OR_Gate (R80.2 U21.1)
EN_UNREG1: M (Q12_M.1), OR_Gate (R108.2 U25.7)
EN_UNREG1_EPS: PMIC (U18.39), OR_Gate (R105.2 U25.2)
EN_UNREG1_SR: SetResetIC (U15.20), OR_Gate (R104.2 U25.1)
EN_UNREG2: OR_Gate (R109.2 U25.3), N (Q12_N.1)
EN_UNREG2_EPS: PMIC (U18.40), OR_Gate (R107.2 U25.6)
EN_UNREG2_SR: SetResetIC (U15.25), OR_Gate (R106.2 U25.5)
EPS_2_OBC: PMIC (R66.1), PC104-52-52 (H1.15)
EPS_2_SR: PMIC (R65.1), SetResetIC (U16.1)
I2C1_SCL: PMIC (U18.92), Ports (J8.2 R128.1)
I2C1_SDA: PMIC (U18.96), Ports (J8.1 R129.1)
Mppt_PWM1: PMIC (U18.59), U_SolarMppt/XY (U32_XY.3)
Mppt_PWM2: PMIC (U18.60), U_SolarMppt/ZX (U32_ZX.3)
Mppt_PWM3: PMIC (U18.61), U_SolarMppt/YZ (U32_YZ.3)
nEN_EPS_3V3: 3V3_EPS (R9.1 U3.4), SetResetIC (U15.2)
nRESET: PMIC_Watchdog (R68.2 U20.6), PMIC_Power (U18.14), PMIC_Debug (J2.1)
nRESET_SR: SetResetIC (U15.7), SRIC_Peripherals (J1.1 R61.2 U17.6)
OBC_2_EPS: PMIC (U19.3), PC104-52-52 (H1.13)
OBC_2_SR: PC104-52-52 (H1.22), SetResetIC (U16.3)
OTG_DM: PMIC (U18.70), Ports (D18.1 J10.2)
OTG_DP: PMIC (U18.71), Ports (D19.1 J10.3)
OTG_ID: PMIC (U18.69), Ports (D20.1 J10.4)
PC14: PMIC (U18.8), PMIC_Crystal (C68.1 Y3.1)
PC14_SR: SetResetIC (U15.3), SRIC_Peripherals (C53.1 Y1.1)
PC15: PMIC (U18.9), PMIC_Crystal (C69.1 Y3.2)
PC15_SR: SetResetIC (U15.4), SRIC_Peripherals (C54.1 Y1.2)
PH0: PMIC (U18.12), PMIC_Crystal (C71.1 Y4.3)
PH0_SR: SetResetIC (U15.5), SRIC_Peripherals (C56.1 Y2.3)
PH1: PMIC (U18.13), PMIC_Crystal (C70.1 Y4.1)
PH1_SR: SetResetIC (U15.6), SRIC_Peripherals (C55.1 Y2.1)
QUADSPI_BK1_IO0: PMIC (U18.43), Mram (U26.5)
QUADSPI_BK1_IO1: PMIC (U18.44), Mram (U26.2)
QUADSPI_BK1_NCS: PMIC (U18.42), Mram (R127.2 U26.1)
QUADSPI_CLK: PMIC (U18.41), Mram (U26.6)
SR_2_EPS: PMIC (U19.1), SetResetIC (R59.1)
SR_2_OBC: PC104-52-52 (H1.24), SetResetIC (R58.1)
SWCLK: PMIC (U18.76), PMIC_Debug (R70.1)
SWCLK_SR: SetResetIC (U15.37), SRIC_Peripherals (R63.1)
SWDIO: PMIC (U18.72), PMIC_Debug (R69.1)
SWDIO_SR: SetResetIC (U15.34), SRIC_Peripherals (R62.1)
SWO: PMIC (U18.89), PMIC_Debug (R71.1)
SWO_SR: SetResetIC (U15.39), SRIC_Peripherals (R64.1)
TDI: PMIC (U18.77), PMIC_Debug (R73.1)
TIM3_CH1: PMIC (U18.63), Ports (J8.5)
TIM3_CH2: PMIC (U18.64), Ports (J8.6)
TRST: PMIC (U18.90), PMIC_Debug (R72.1)
UART4_RX: PMIC (U18.79), Ports (J8.3)
UART4_TX: PMIC (U18.78), Ports (J8.4)
UNREG_1: PC104-52-52 (H1.43 H1.44 H2.43 H2.44), M (C47_M.2 R54_M.2 R55_M.2 U14_M.4)
UNREG_2: PC104-52-52 (H1.45 H1.46 H2.45 H2.46), N (C47_N.2 R54_N.2 R55_N.2 U14_N.4)
USART1_RX_SR: SetResetIC (U15.31), SRIC_Peripherals (D23.1 J5.3)
USART1_TX_SR: SetResetIC (U15.30), SRIC_Peripherals (D22.1 J5.2)
VBUS: A (5 pins), 5V0_VoltageReg (C34.2 C35.2 L4.1 U10.3), 3V3_MCU (5 pins), 3V3_EPS (5 pins), M (R49_M.1 R50_M.1 R51_M.1 U13_M.8), Ports (J9.5 J9.6 J9.7 J9.8), B (5 pins), N (R49_N.1 R50_N.1 R51_N.1 U13_N.8)
VDD_MCU: PC104-52-52 (H1.17 H1.18 R130.1), 3V3_MCU (C22.2 R22.2 U6.4)
Vout_Panels: Ports (J9.9 J9.10), SolarMppt (9 pins), U_SolarMppt/XY (D15_XY.1), U_SolarMppt/ZX (D15_ZX.1), U_SolarMppt/YZ (D15_YZ.1)
WAKE: PMIC (U18.66), PMIC_Watchdog (U20.5)
WAKE_SR: SetResetIC (U15.32), SRIC_Peripherals (U17.5)